# Altium schematic sheet P1_Sch.SchDoc
size A4; SheetNumber: 1; SheetTotal: 1
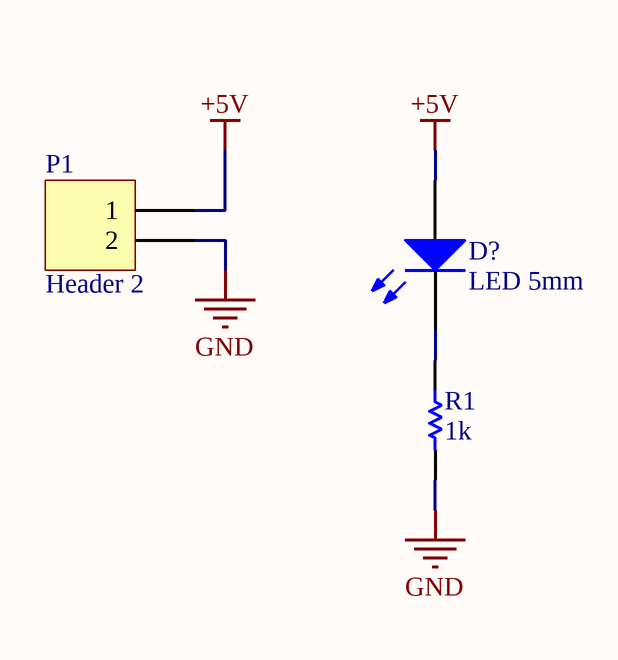
[diagram p0: P1_Sch.SchDoc]

## Parts
D?  LED 5mm  [LED-1]
P1  Header 2  [HDR1X2]
R1  1k  [AXIAL-0.3]

## Nets
+5V: D?.1(A) P1.1
GND: P1.2 R1.2
NetD?_2: D?.2(K) R1.1

## Library data of the parts
D? = LED1: Typical RED GaAs LED; Published: 8-Jun-2000; LatestRevisionDate: 08-Jul-2005; LatestRevisionNote: Mech Layer 1 removed.; PackageReference: LED-1; Publisher: Altium Limited; PackageDescription: LED; 2 Leads
P1 = Header 2: Header, 2-Pin; LatestRevisionDate: 17-Jul-2002; LatestRevisionNote: Re-released for DXP Platform.; Publisher: Altium Limited
R1 = Res1: Resistor; Published: 8-Jun-2000; LatestRevisionDate: 17-Jul-2002; LatestRevisionNote: Re-released for DXP Platform.; PackageReference: AXIAL-0.3; Publisher: Altium Limited; PackageDescription: Axial Device, Thru-Hole; 2 Leads; 0.3 in Pin Spacing; Value: 1K